# Altium schematic sheet Display.SchDoc: Display Interface
size A4; Author: Paweł Pieńczuk; CompanyName: Koło Naukowe Systemów Scalonych; DrawnBy: Paweł Pieńczuk; Engineer: Paweł Pieńczuk; Organization: KNSS; Address1: Koło Naukowe; Address2: Systemów Scalonych; Address3: 00-665 Warszawa; Address4: Nowowiejska 15/19; DocumentNumber: 4; Revision: 1.0; SheetNumber: 4; SheetTotal: 4
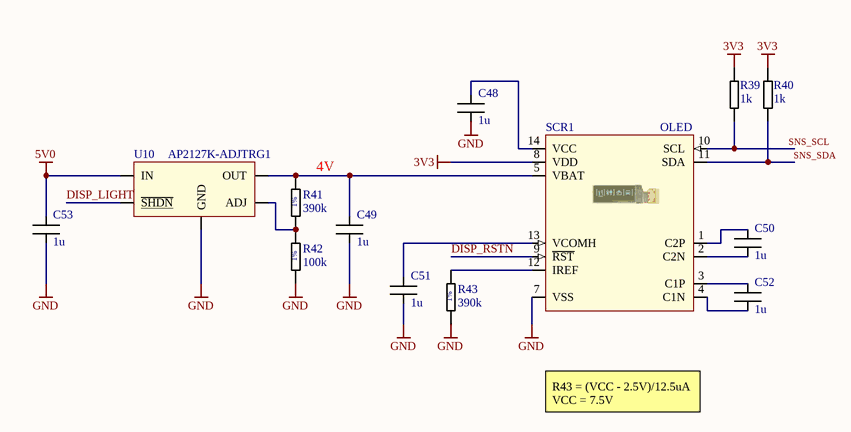
[diagram p0: Display.SchDoc]

## Parts
C48  value 1u  [CAPC1608N]  (hidden comment: Capacitor)
C49  value 1u  [CAPC1608N]  (hidden comment: Capacitor)
C50  value 1u  [CAPC1608N]  (hidden comment: Capacitor)
C51  value 1u  [CAPC1608N]  (hidden comment: Capacitor)
C52  value 1u  [CAPC1608N]  (hidden comment: Capacitor)
C53  value 1u  [CAPC1608N]  (hidden comment: Capacitor)
R39  value 1k  [RESC1005N]  (hidden comment: Resistor)
R40  value 1k  [RESC1005N]  (hidden comment: Resistor)
R41  value 390k  Tolerance: 1%  [RESC1005N]  (hidden comment: Resistor)
R42  value 100k  Tolerance: 1%  [RESC1005N]  (hidden comment: Resistor)
R43  value 390k  Tolerance: 1%  [RESC1005N]  (hidden comment: Resistor)
SCR1  OLED  [REX012832FSPP3N00000]
U10  AP2127K-ADJTRG1  [SOT-23-5]

## Nets
3V3: R39.1 R40.1 SCR1.8(VDD)
5V0: C53.2 U10.1(IN)
GND: C48.1 C49.1 C51.1 C53.1 R42.2 R43.2 SCR1.7(VSS) U10.2(GND)
DISP_LIGHT: U10.3(~{SHDN})
DISP_RSTN: SCR1.9(~{RST})
SNS_SCL: R39.2 SCR1.10(SCL)
SNS_SDA: R40.2 SCR1.11(SDA)
NetC48_2: C48.2 SCR1.14(VCC)
NetC49_2: C49.2 R41.1 SCR1.5(VBAT) U10.5(OUT)
NetC50_1: C50.1 SCR1.2(C2N)
NetC50_2: C50.2 SCR1.1(C2P)
NetC51_2: C51.2 SCR1.13(VCOMH)
NetC52_1: C52.1 SCR1.4(C1N)
NetC52_2: C52.2 SCR1.3(C1P)
NetR41_2: R41.2 R42.1 U10.4(ADJ)
NetR43_1: R43.1 SCR1.12(IREF)

## Notes on the sheet
- (near R41) 4V
- R43 = (VCC - 2.5V)/12.5uA
  VCC = 7.5V
- Project:
- Variant:
- File:
- Sheet:
- Revision:
- Total Sheet:
- Author:
- Modified:

## Library data of the parts
C48-C53 = Capacitor: 0603 imperial SMD Capacitor; Manufacturer 1: Samsung; Manufacturer Part Number 1: CL10B105KO8NNNC; Tolerance: 10%; MaxVoltage: 16V; Supplier 1: TME; Supplier Part Number 1: CL10B105KO8NNNC
R39 R40 = Resistor: 0402 Film SMD Resistor; Manufacturer 1: TE CONNECTIVITY; Manufacturer Part Number 1: CRG0402J1K0; Tolerance: 1%; Power: 0.1W; Supplier 1: Farnell; Supplier Part Number 1: 1174154; Manufacturer Part Number 2: CRCW04021K00FKTDBC; Manufacturer 2: VISHAY; Supplier 2: TME; Supplier Part Number 2: CRCW04021K00FKTDBC
R41 R43 = Resistor: 0402 Film SMD Resistor; Manufacturer 1: ROYAL OHM; Manufacturer Part Number 1: 0402WGF3903TCE; Power: 63mW; Supplier 1: TME; Supplier Part Number 1: SMD0402-390K-1%
R42 = Resistor: 0402 Film SMD Resistor; Manufacturer 1: ROYAL OHM; Manufacturer Part Number 1: CQ02WGF1003TCE; Power: 63mW; Supplier 1: TME; Supplier Part Number 1: CQ0402-100K-1%
SCR1 = REX012832FSPP3N00000: Wyświetlacz: OLED; graficzny; 0,91"; 128x32; Wym:30x11,5x1,45mm; Manufacturer 1: RAYSTAR OPTRONICS; Manufacturer Part Number 1: REX012832FSPP3N00000; Pin Count: 14; Supplier 1: TME; Supplier Part Number 1: REX012832FSPP3N0; Size: 0.91"
U10 = AP2127K-ADJTRG1: 0.4A, 0.8-5.5V, linear LDO, adjustable, SOT-23-5 package; Manufacturer 1: DIODES INCORPORATED; Supplier 1: AP2127K-ADJTRG1; Supplier Part Number 1: TME; ComponentLink1Description: Datasheet; ComponentLink1URL: https://www.tme.eu/pl/Document/c6dd416f88a2434475547c25f5623504/AP2127.pdf; Manufacturer Part Number 1: AP2127K-ADJTRG1